# EasyEDA Pro project power_supply_14V.eprj

# Schematic Schematic1
Board Name: Board1; Create Date: 2025-10-17; Page Name: P1; Project Name: power_supply_14V; Schematic Name: Schematic1; Update Date: 2025-10-19; Company: 嘉立创EDA; Page Size: A4; Version: V1.0
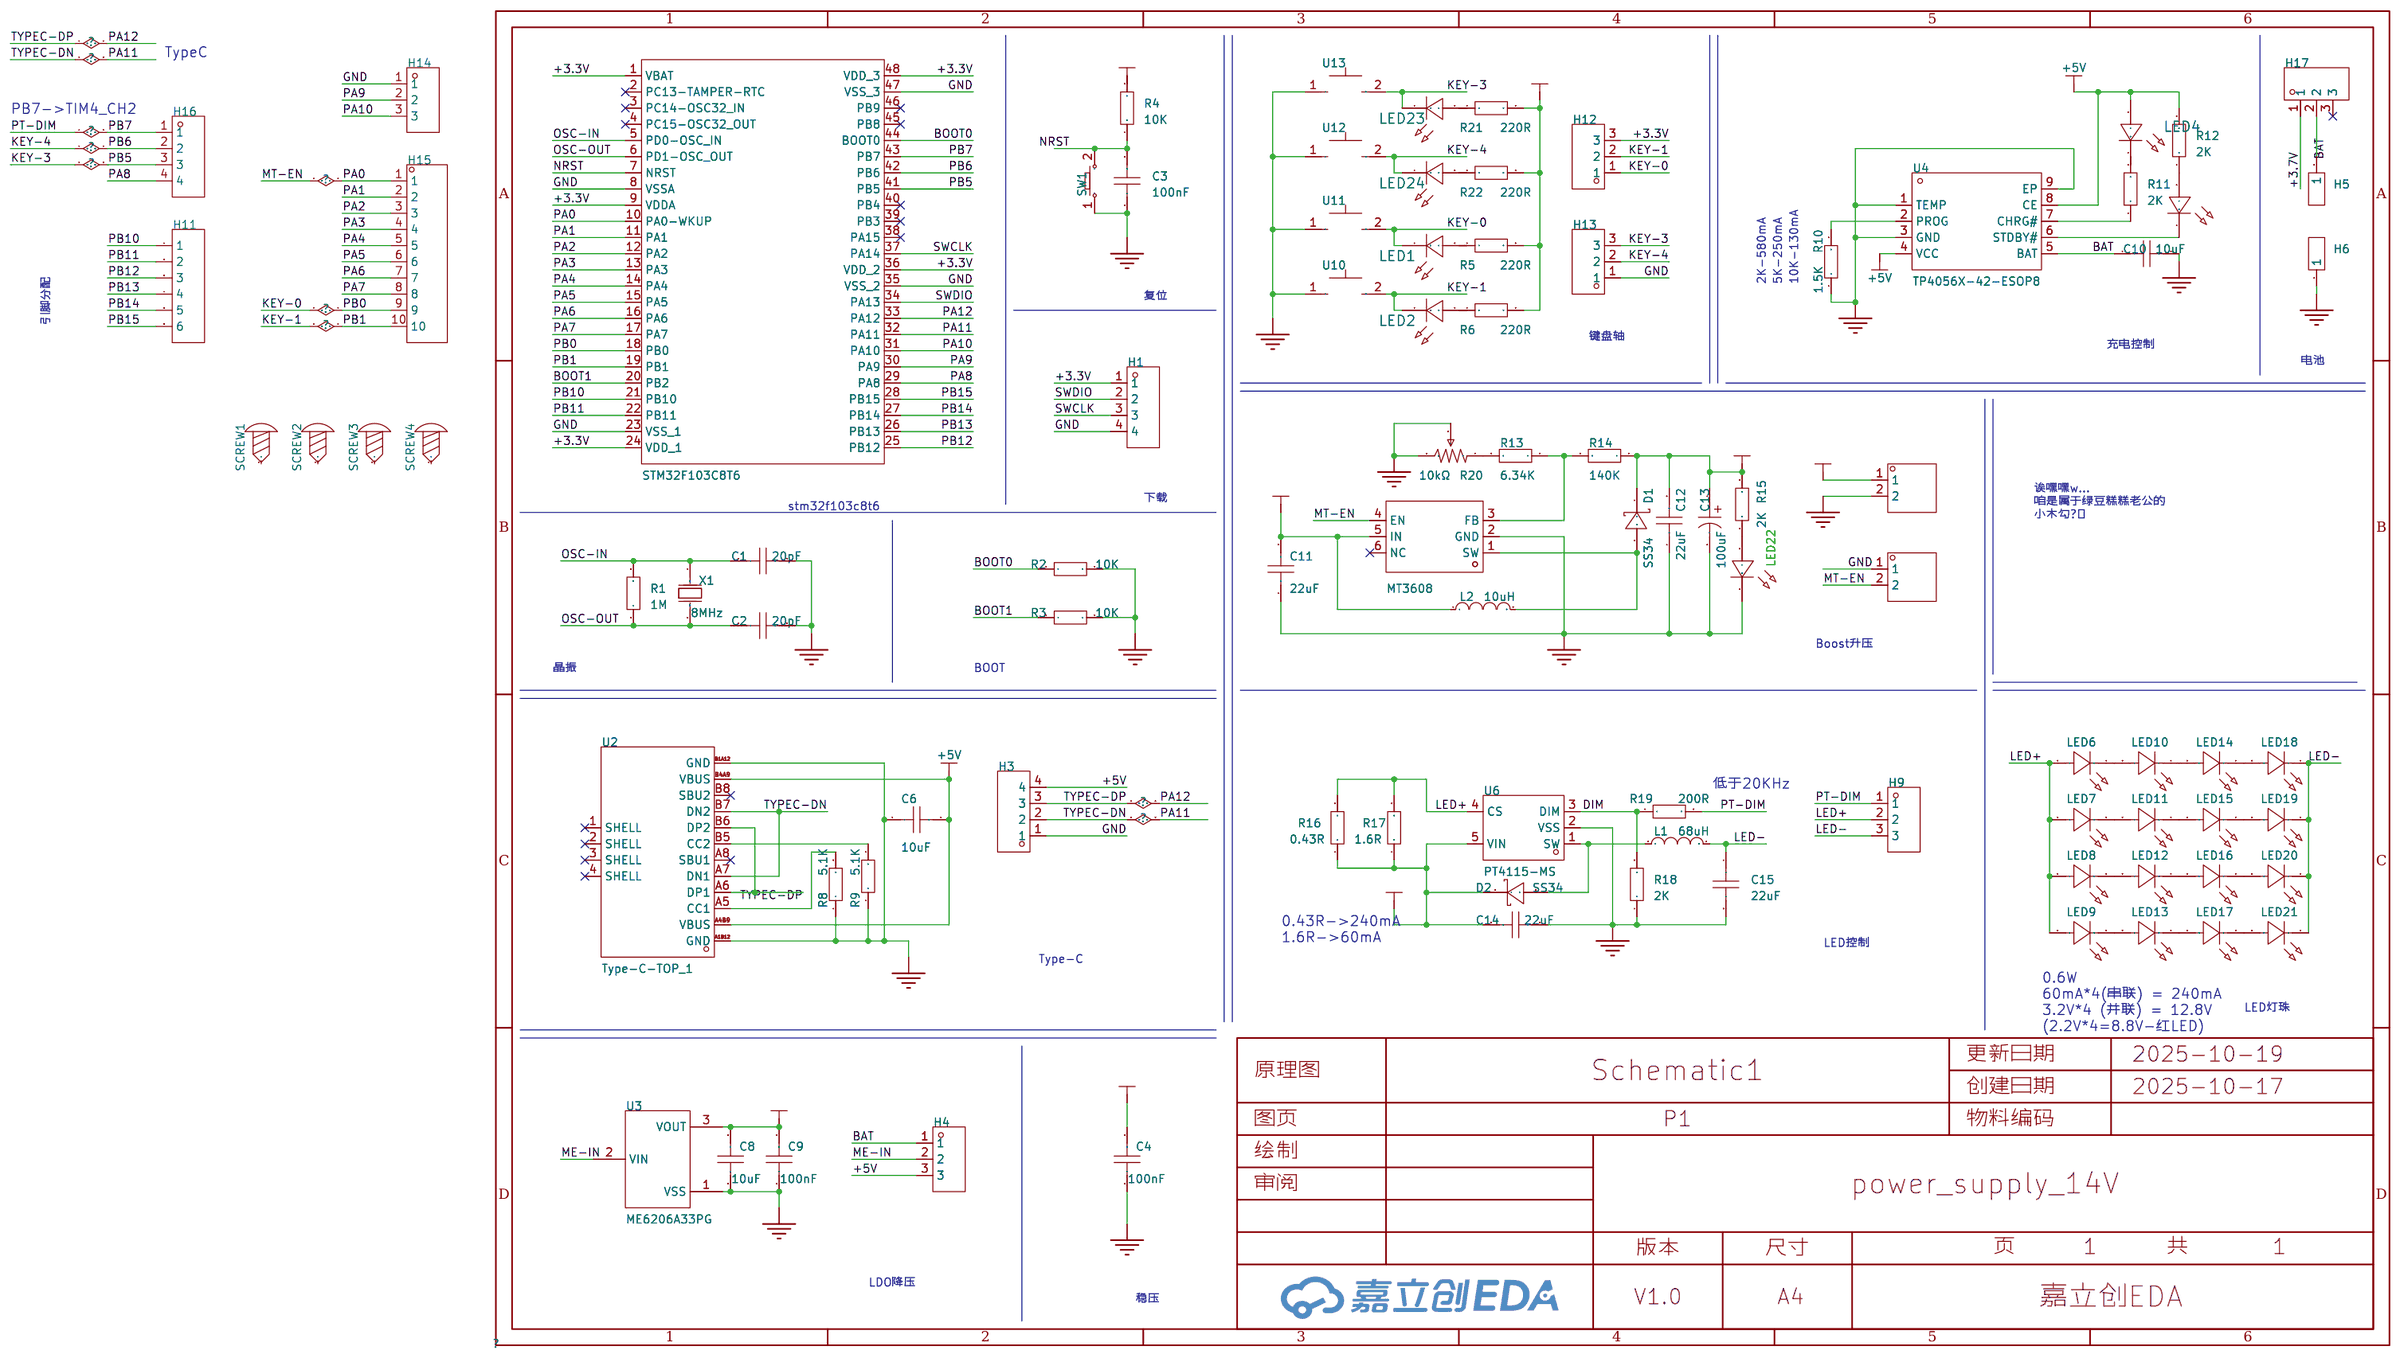
[diagram p0: schematic sheet]

## Parts
C1  20pF  [C0805]
C2  20pF  [C0805]
C3  100nF  [C0805]
C4  100nF  [C0805]
C6  10uF  [C0805]
C8  10uF  [C0805]
C9  100nF  [C0805]
C10  10uF  [C0805]
C11  22uF  [C0805]
C12  22uF  [C0805]
C13  100uF  [CAP-SMD_BD6.3-L6.6-W6.6-FD-1]
C14  22uF  [C0805]
C15  22uF  [C0805]
D1  SS34  [SMA_L4.3-W2.6-LS5.2-RD]
D2  SS34  [SMA_L4.3-W2.6-LS5.2-RD]
H1  -  [HDR-TH_4P-P2.54-V-M]
H3  -  [HDR-TH_4P-P2.54-V-M]
H4  -  [HDR-TH_3P-P2.54-V-M]
H5  -  [HDR-TH_1P-V-M_XKB_X4611WV-01I-C28D40]
H6  -  [HDR-TH_1P-V-M_XKB_X4611WV-01I-C28D40]
H7  -  [HDR-TH_2P-P2.54-V-M-1]
H8  -  [HDR-TH_2P-P2.54-V-M-1]
H9  -  [HDR-TH_3P-P2.54-V-M]
H11  -  [HDR-TH_6P-P2.54-V-M-1]
H12  -  [HDR-TH_3P-P2.54-V-M]
H13  -  [HDR-TH_3P-P2.54-V-M]
H14  -  [HDR-TH_3P-P2.54-V-M]
H15  -  [HDR-TH_10P-P2.54-V-M-1]
H16  -  [HDR-TH_4P-P2.54-V-F]
H17  -  [HDR-TH_3P-P2.54-V-M]
L1  68uH  [IND-SMD_L5.8-W5.2]
L2  10uH  [IND-SMD_L7.3-W6.6]
LED1  -  [LED_0805]
LED2  -  [LED_0805]
LED4  -  [LED_0805]
LED5  -  [LED_0805]
LED6  XL-2835UWC-02  [LED-SMD_L3.5-W2.8-RD_1.25T-2PWT]
LED7  XL-2835UWC-02  [LED-SMD_L3.5-W2.8-RD_1.25T-2PWT]
LED8  XL-2835UWC-02  [LED-SMD_L3.5-W2.8-RD_1.25T-2PWT]
LED9  XL-2835UWC-02  [LED-SMD_L3.5-W2.8-RD_1.25T-2PWT]
LED10  XL-2835UWC-02  [LED-SMD_L3.5-W2.8-RD_1.25T-2PWT]
LED11  XL-2835UWC-02  [LED-SMD_L3.5-W2.8-RD_1.25T-2PWT]
LED12  XL-2835UWC-02  [LED-SMD_L3.5-W2.8-RD_1.25T-2PWT]
LED13  XL-2835UWC-02  [LED-SMD_L3.5-W2.8-RD_1.25T-2PWT]
LED14  XL-2835UWC-02  [LED-SMD_L3.5-W2.8-RD_1.25T-2PWT]
LED15  XL-2835UWC-02  [LED-SMD_L3.5-W2.8-RD_1.25T-2PWT]
LED16  XL-2835UWC-02  [LED-SMD_L3.5-W2.8-RD_1.25T-2PWT]
LED17  XL-2835UWC-02  [LED-SMD_L3.5-W2.8-RD_1.25T-2PWT]
LED18  XL-2835UWC-02  [LED-SMD_L3.5-W2.8-RD_1.25T-2PWT]
LED19  XL-2835UWC-02  [LED-SMD_L3.5-W2.8-RD_1.25T-2PWT]
LED20  XL-2835UWC-02  [LED-SMD_L3.5-W2.8-RD_1.25T-2PWT]
LED21  XL-2835UWC-02  [LED-SMD_L3.5-W2.8-RD_1.25T-2PWT]
LED22  -  [LED_0805]
LED23  -  [LED_0805]
LED24  -  [LED_0805]
R1  1M  [R0805]
R2  10K  [R0805]
R3  10K  [R0805]
R4  10K  [R0805]
R5  220R  [R0805]
R6  220R  [R0805]
R8  5.1K  [R0805]
R9  5.1K  [R0805]
R10  1.5K  [R0805]
R11  2K  [R0805]
R12  2K  [R0805]
R13  6.34K  [R0805]
R14  140K  [R0805]
R15  2K  [R0805]
R16  0.43R  [R0805]
R17  1.6R  [R0805]
R18  2K  [R0805]
R19  200R  [R0805]
R20  10kΩ  [RES-ADJ-SMD_3P-L3.0-W3.8-P1.75-BR]
R21  220R  [R0805]
R22  220R  [R0805]
SCREW1  -  [M3螺丝]
SCREW2  -  [M3螺丝]
SCREW3  -  [M3螺丝]
SCREW4  -  [M3螺丝]
SW1  -  [Key_SMD_3x4x2]
U1  STM32F103C8T6  [LQFP-48_L7.0-W7.0-P0.50-LS9.0-BL]
U2  Type-C-TOP_1  [USB-C-SMD_TYPE-C16PIN]
U3  ME6206A33PG  [SOT-89-3_L4.5-W2.5-P1.50-LS4.2-BR]
U4  TP4056X-42-ESOP8  [SOP-8_L4.9-W3.9-P1.27-LS6.0-TL-EP]
U5  MT3608  [SOT-23-6_L2.9-W1.6-P0.95-LS2.8-BL]
U6  PT4115-MS  [SOT-89-5_L4.5-W2.5-P1.50-LS4.6-BL]
U10  -  [高特轴轴体]
U11  -  [高特轴轴体]
U12  CPG151101S11-16  [SMD_KEYBOARD-SW]
U13  CPG151101S11-16  [SMD_KEYBOARD-SW]
X1  8MHz  [CRYSTAL-SMD_L11.5-W4.8-LS12.7]

## Library data of the parts
C1-C4 C6 C8-C12 C14 C15 = CAP_0805: Supplier Footprint: 0805
C13 = JVJ25V100M6x5: LCSC Part Name: 100uF ±20% 25V; Supplier Part: C46550402; Manufacturer: JIERR(捷而瑞); Supplier Footprint: SMD,D6.3xL5.4mm; JLCPCB Part Class: 扩展库; Datasheet: https://item.szlcsc.com/datasheet/JVJ25V100M6x5/48680096.html; Supplier: LCSC; Tolerance: ±20%; Voltage Rating: 25V; Ripple Current: 72mA@120Hz; Diameter: 6.3mm; Height - Seated (Max): 5.4mm; Lifetime: 2000hrs@105℃; Operating Temperature: -55℃~+105℃
D1 D2 = SS34_C8678: LCSC Part Name: 电压:40V 电流:3A; Supplier Part: C8678; Manufacturer: MDD(辰达半导体); Supplier Footprint: SMA(DO-214AC); JLCPCB Part Class: 基础库; Datasheet: https://item.szlcsc.com/datasheet/SS34/9178.html; Supplier: LCSC; Diode Configuration: 独立式; Voltage - Forward(Vf@If): 550mV@3A; Voltage - DC Reverse(Vr): 40V; Current - Rectified: 3A; Reverse Leakage Current (Ir): 500uA@40V; Operating Junction Temperature Range: -55℃~+125℃
H1 H3 = HDR-M_2.54_1x4P: Supplier Part: C492403; Supplier Footprint: 插件
H4 H9 H12-H14 H17 = HDR-M_2.54_1x3P: Supplier Part: C2937625; Supplier Footprint: 插件
H5 H6 = HDR-M_2.54_1x1P: Supplier Part: C81276; Supplier Footprint: 插件; JLCPCB Part Class: Extended Part
H7 H8 = HDR-M_2.54_1x2P: Supplier Part: C124375; Supplier Footprint: 插件
H11 = HDR-M_2.54_1x6P: Supplier Part: C37208; Supplier Footprint: 插件
H15 = HDR-M_2.54_1x10P: Supplier Part: C57369; Supplier Footprint: 插件
H16 = HDR-F_2.54_1x4P: Supplier Part: C2718488; Supplier Footprint: 插件
L1 = MSCD54-680KT: LCSC Part Name: 68uH ±10%; Supplier Part: C915201; Manufacturer: MetalLions(美铼); Supplier Footprint: SMD,5.8x5.2mm; JLCPCB Part Class: 扩展库; Datasheet: https://atta.szlcsc.com/upload/public/pdf/source/20201106/C915140_34E6DDD06C756689AFD995263E08DECA.pdf; Supplier: LCSC; Tolerance: ±10%
L2 = SMMS0630-100M: LCSC Part Name: 10uH ±20% 5.5A; Supplier Part: C128692; Manufacturer: SXN(顺翔诺); Supplier Footprint: SMD,7.3x6.6mm; JLCPCB Part Class: 扩展库; Datasheet: https://item.szlcsc.com/datasheet/SMMS0630-100M/139977.html; Supplier: LCSC; Tolerance: ±20%; Current - Saturation(Isat): 5.5A; DC Resistance(DCR): 68mΩ
LED1 LED2 LED4 LED23 LED24 = LED_0805-R: Supplier Footprint: 0805
LED5 LED22 = LED_0805-G: Supplier Footprint: 0805
LED6-LED21 = XL-2835UWC-02: LCSC Part Name: 2835白0.2W贴片式发光二极管; Supplier Part: C2843876; Manufacturer: XINGLIGHT(成兴光); Supplier Footprint: SMD2835-2P; JLCPCB Part Class: 扩展库; Datasheet: https://item.szlcsc.com/datasheet/XL-2835UWC-02/3033177.html; Supplier: LCSC; Illumination Color: 白色; Voltage - Forward(Vf): 3.4V; Power(Watts): 200mW; Forward Current: 60mA; Lens Color: 黄色透镜; Color Temperature: 6000K~7500K; Viewing Angle: 120°; Mounting Style: 正贴; Operating Temperature: -20℃~+85℃
R1-R6 R8-R19 R21 R22 = Res_0805: Supplier Footprint: 0805
R20 = TC33X-2-103E: LCSC Part Name: 10kΩ ±25%; Supplier Part: C719176; Manufacturer: BOURNS; Supplier Footprint: SMD-3P,3.8x3.6mm; JLCPCB Part Class: 扩展库; Datasheet: https://item.szlcsc.com/datasheet/TC33X-2-103E/762158.html; Supplier: LCSC; Tolerance: ±25%; Power(Watts): 150mW; Temperature Coefficient: ±250ppm/℃; Number of Turns: 1
SCREW1-SCREW4 = M3螺丝: Supplier Footprint: 插件
SW1 = Key_SMD_3x4x2: Supplier Footprint: SMD
U1 = STM32F103C8T6_C9900100366: Supplier Part: C9900100366; Supplier Footprint: TH-6P; JLCPCB Part Class: 扩展库; Supplier: LCSC
U2 = Type-C-TOP_1: Supplier Part: C9900005857; Supplier Footprint: Type-C16P; JLCPCB Part Class: 扩展库; Supplier: LCSC
U3 = ME6206A33PG: 输出类型:固定;工作电压:6V;输出电压:3.3V;输出电流:300mA;电源纹波抑制比(PSRR):50dB@(1kHz);输出极性:正极;; LCSC Part Name: 输入6V 输出3.3V 300mA; Supplier Part: C79022; Manufacturer: MICRONE(南京微盟); Supplier Footprint: SOT-89-3; JLCPCB Part Class: 扩展库; Datasheet: https://item.szlcsc.com/datasheet/ME6206A33PG/80159.html; Supplier: LCSC; Output Type: 固定; Voltage - Supply: 6V; Output Voltage: 3.3V; Output Current: 300mA; Power Supply Rejection Ratio (PSRR): 50dB@(1kHz); Voltage Dropout: 180mV@(80mA)；380mV@(200mA); standby current: 9uA; Features: 过流保护; Operating Temperature: -25℃~+85℃; Output Configuration: 正极; Number of Outputs: 1
U4 = TP4056X-42-ESOP8: 工作电压:4V~8V;最大充电电流:1A;电池类型:锂离子/聚合物;电池节数:1;; Supplier Part: C2763448; Manufacturer: TOPPOWER(南京拓微); Supplier Footprint: SOP-8-EP; JLCPCB Part Class: 扩展库; Datasheet: https://item.szlcsc.com/datasheet/TP4056X-42-ESOP8/2893069.html; Supplier: LCSC; The Chip Type: 线性充电芯片; Voltage - Supply: 4V~8V; Charge Current - Max: 1A; Charging Saturation Voltage: 4.2V; Type of Battery: 锂离子/聚合物; Number of Cells: 1; Operating Temperature: -40℃~+85℃; Battery Temperature Detection: 支持; Supply Current (Iq): 70uA
U5 = MT3608: LCSC Part Name: 老版本 高效1.2MHz 2A升压转换器; Supplier Part: C84817; Manufacturer: 西安航天民芯; Supplier Footprint: SOT-23-6; JLCPCB Part Class: 扩展库; Datasheet: https://item.szlcsc.com/datasheet/MT3608/85988.html; Supplier: LCSC; Function: 升压型; Output Type: 可调; Voltage - Supply: 2V~24V; Output Current: 2A; Frequency - Switching: 1.2MHz; Operating Temperature: -40℃~+85℃; Synchronous Rectifier: 否; Number of Outputs: 1; Topology: 升压式; Quiescent Current: 100uA；1.6mA; Switch tube (built-in/external): 内置
U6 = PT4115-MS: LCSC Part Name: 降压型LED恒流驱动器; Supplier Part: C7473160; Manufacturer: MSKSEMI(美森科); Supplier Footprint: SOT89-5; JLCPCB Part Class: 扩展库; Datasheet: https://item.szlcsc.com/datasheet/PT4115-MS/8533534.html; Supplier: LCSC; Voltage - Input(DC): 5.5V~30V; Frequency - Switching: 1MHz; Number of Channels: 1; Output Current: 1A; Dimming: PWM；模拟; Topology: 降压; Operating temperature: -40℃~+150℃
U10 U11 = 高特轴-焊盘
U12 U13 = CPG151101S11-16_C41430893: LCSC Part Name: 热插拔底座连接器 键盘配件; Supplier Part: C41430893; Manufacturer: HanElectricity(瀚源); Supplier Footprint: SMD,14.5x5.9mm; JLCPCB Part Class: 扩展库; Datasheet: https://item.szlcsc.com/datasheet/CPG151101S11-16/43288200.html; Supplier: LCSC
X1 = X49SM8MSD2SC: 晶振类型:贴片晶振;频率:8MHz;常温频差:±20ppm;外接负载电容:20pF;频率稳定度(全温):±30ppm;; LCSC Part Name: 8MHz ±20ppm 20pF; Supplier Part: C12674; Manufacturer: YXC(扬兴晶振); Supplier Footprint: HC-49S-SMD; JLCPCB Part Class: 基础库; Datasheet: https://atta.szlcsc.com/upload/public/pdf/source/20240329/3EBF42EBCAB50CA65B6FA9D7CFA1955A.pdf; Supplier: LCSC; Crystal Type: 贴片晶振; Normal temperature Frequency Tolerance: ±20ppm; External load capacitor: 20pF; Frequency Stability(Full temperature range): ±30ppm; Operating Temperature: -20℃~+70℃; Check: true

## Nets
+3.3V: C4.2 C8.2 C9.2 H1.1 H12.3 R4.2 R5.2 R6.2 R21.2 R22.2 U1.1(VBAT) U1.9(VDDA) U1.24(VDD_1) U1.36(VDD_2) U1.48(VDD_3) U3.3(VOUT)
+3.7V: C11.2 H17.1 L2.1 U5.5(IN)
+5V: C6.2 H3.4 H4.3 LED4.2(A) R12.2 U2.A4B9(VBUS) U2.B4A9(VBUS) U4.4(VCC) U4.8(CE)
+14V: C12.2 C13.1 C14.2 D1.1(K) D2.1(K) H7.1 R14.1 R15.2 R16.1 R17.1 U6.5(VIN)
GND: C1.2 C2.2 C3.1 C4.1 C6.1 C8.1 C9.1 C10.2 C11.1 C12.1 C13.2 C14.1 C15.2 H1.4 H3.1 H6.1 H7.2 H8.1 H13.1 H14.1 LED22.1(C) R2.2 R3.2 R8.1 R9.1 R10.1 R18.1 R20.2 R20.3 SW1.1 U1.8(VSSA) U1.23(VSS_1) U1.35(VSS_2) U1.47(VSS_3) U2.A1B12(GND) U2.B1A12(GND) U3.1(VSS) U4.1(TEMP) U4.3(GND) U4.9(EP) U5.2(GND) U6.2(VSS) U10.1 U11.1 U12.1 U13.1
BAT: C10.1 H4.1 H5.1 H17.2 U4.5(BAT)
BOOT0: R2.1 U1.44(BOOT0)
BOOT1: R3.1 U1.20(PB2)
DIM: R18.2 R19.1 U6.3(DIM)
KEY-0: H12.1 H15.9 LED1.1(C) U1.18(PB0) U11.2
KEY-1: H12.2 H15.10 LED2.1(C) U1.19(PB1) U10.2
KEY-3: H13.3 H16.3 LED23.1(C) U1.41(PB5) U13.2
KEY-4: H13.2 H16.2 LED24.1(C) U1.42(PB6) U12.2
LED+: H9.2 LED6.2(A) LED7.2(A) LED8.2(A) LED9.2(A) R16.2 R17.2 U6.4(CS)
LED-: C15.1 H9.3 L1.2 LED18.1(K) LED19.1(K) LED20.1(K) LED21.1(K)
ME-IN: H4.2 U3.2(VIN)
MT-EN: H8.2 H15.1 U1.10(PA0-WKUP) U5.4(EN)
NRST: C3.2 R4.1 SW1.2 U1.7(NRST)
OSC-IN: C1.1 R1.2 U1.5(PD0-OSC_IN) X1.1(OSC1)
OSC-OUT: C2.1 R1.1 U1.6(PD1-OSC_OUT) X1.2(OSC2)
PA1: H15.2 U1.11(PA1)
PA2: H15.3 U1.12(PA2)
PA3: H15.4 U1.13(PA3)
PA4: H15.5 U1.14(PA4)
PA5: H15.6 U1.15(PA5)
PA6: H15.7 U1.16(PA6)
PA7: H15.8 U1.17(PA7)
PA8: H16.4 U1.29(PA8)
PA9: H14.2 U1.30(PA9)
PA10: H14.3 U1.31(PA10)
PA11: H3.2 U1.32(PA11) U2.A7(DN1) U2.B7(DN2)
PA12: H3.3 U1.33(PA12) U2.A6(DP1) U2.B6(DP2)
PB7: H9.1 H16.1 R19.2 U1.43(PB7)
PB10: H11.1 U1.21(PB10)
PB11: H11.2 U1.22(PB11)
PB12: H11.3 U1.25(PB12)
PB13: H11.4 U1.26(PB13)
PB14: H11.5 U1.27(PB14)
PB15: H11.6 U1.28(PB15)
SWCLK: H1.3 U1.37(PA14)
SWDIO: H1.2 U1.34(PA13)
$1N246: R13.1 R14.2 U5.3(FB)
$1N536: D1.2(A) L2.2 U5.1(SW)
$1N2412: D2.2(A) L1.1 U6.1(SW)
$1N3223: R11.1 U4.7(CHRG#)
$1N3224: LED5.1(C) U4.6(STDBY#)
$1N3229: R10.2 U4.2(PROG)
$1N3661: LED6.1(K) LED10.2(A)
$1N3707: LED10.1(K) LED14.2(A)
$1N3753: LED14.1(K) LED18.2(A)
$1N3931: LED7.1(K) LED11.2(A)
$1N3933: LED11.1(K) LED15.2(A)
$1N3935: LED15.1(K) LED19.2(A)
$1N4113: LED8.1(K) LED12.2(A)
$1N4115: LED12.1(K) LED16.2(A)
$1N4117: LED16.1(K) LED20.2(A)
$1N4295: LED9.1(K) LED13.2(A)
$1N4297: LED13.1(K) LED17.2(A)
$1N4299: LED17.1(K) LED21.2(A)
$1N4815: R8.2 U2.A5(CC1)
$1N4872: R9.2 U2.B5(CC2)
$1N5072: LED1.2(A) R5.1
$1N5233: LED2.2(A) R6.1
$1N7576: LED22.2(A) R15.1
$1N7618: R13.2 R20.1
$1N7867: LED23.2(A) R21.1
$1N7949: LED24.2(A) R22.1
$1N8425: LED5.2(A) R12.1
$1N10744: LED4.1(C) R11.2

Not connected (* = marked no-connect by the designer): H17 3*; SCREW1 1; SCREW2 1; SCREW3 1; SCREW4 1; U1 2(PC13-TAMPER-RTC)* 3(PC14-OSC32_IN)* 4(PC15-OSC32_OUT)* 38(PA15)* 39(PB3)* 40(PB4)* 45(PB8)* 46(PB9)*; U2 1(SHELL)* 2(SHELL)* 3(SHELL)* 4(SHELL)* A8(SBU1)* B8(SBU2)*; U5 6(NC)*

## Notes on the sheet
- TypeC
- PB7->TIM4_CH2
- 2K-580mA
- 5K-250mA
- 10K-130mA
- 复位
- 引脚分配
- 键盘轴
- 充电控制
- 电池
- stm32f103c8t6
- 下载
- 诶嘿嘿w...
  咱是属于绿豆糕糕老公的
  小木勾🥰❤️
- Boost升压
- 晶振
- BOOT
- 低于20KHz
- 0.43R->240mA
  1.6R->60mA
- LED控制
- Type-C
- 0.6W
  60mA*4(串联) = 240mA
  3.2V*4 (并联) = 12.8V
  (2.2V*4=8.8V-红LED)
- LED灯珠
- LDO降压
- 稳压

# Board PCB1
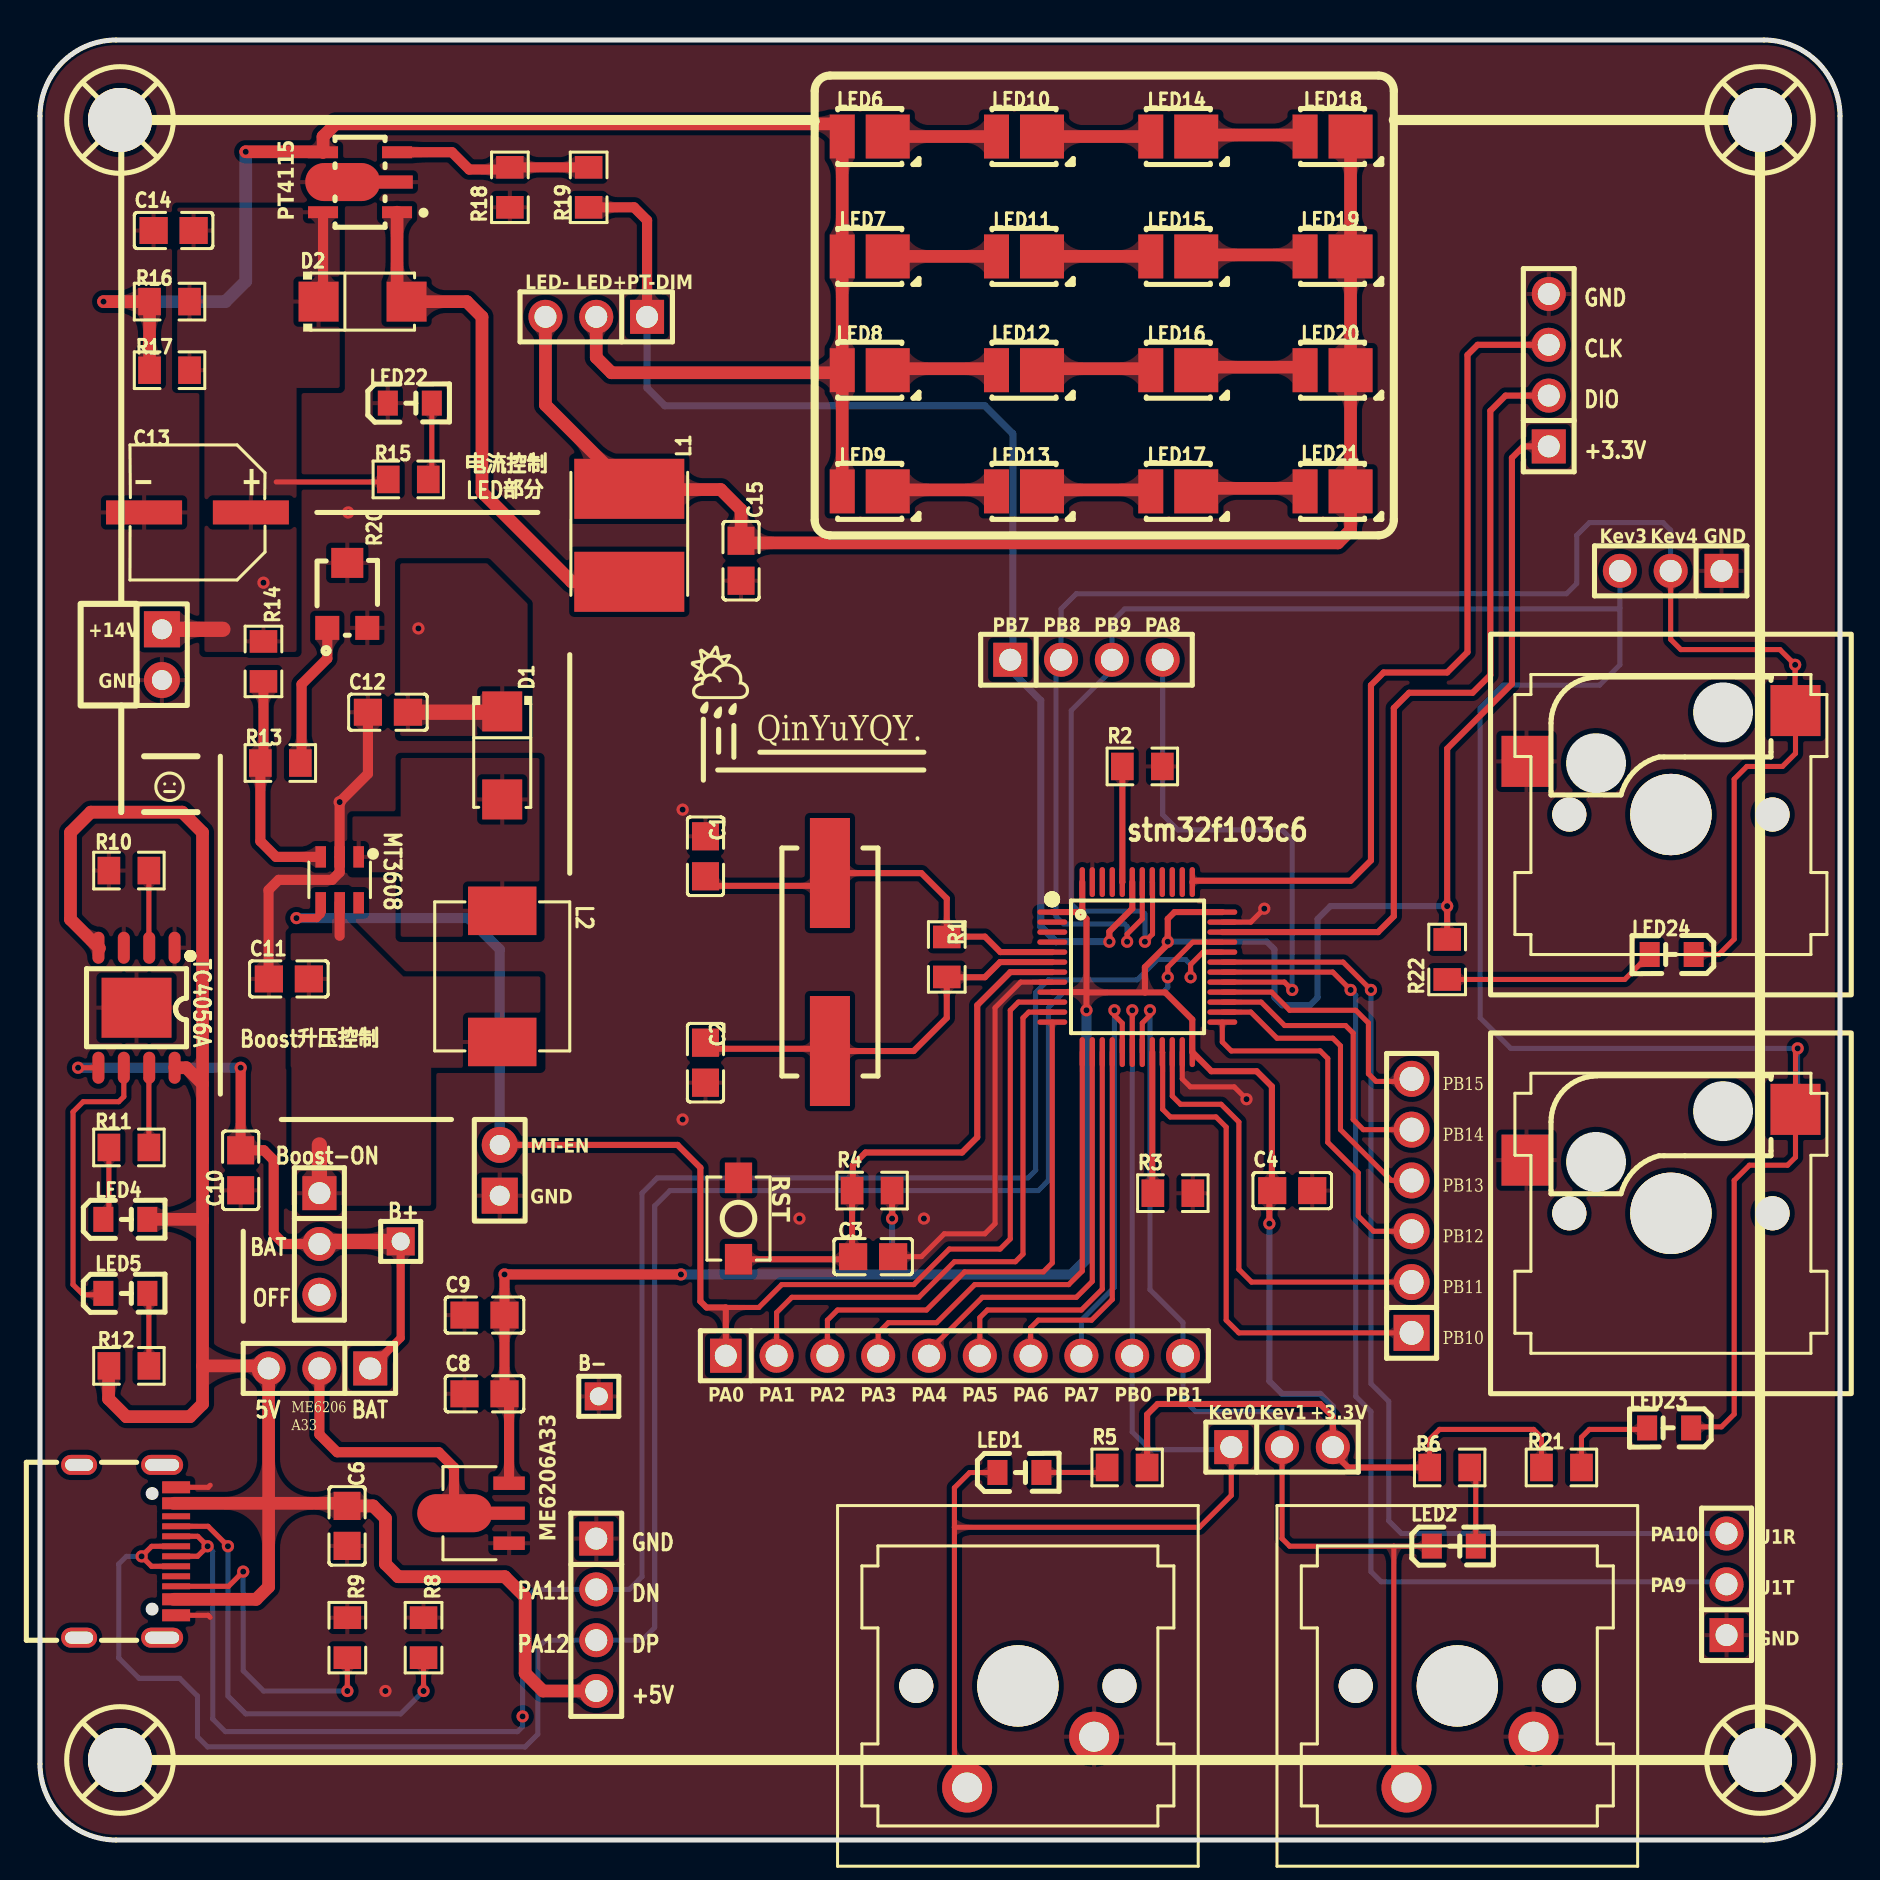
[diagram p1: board, top side]
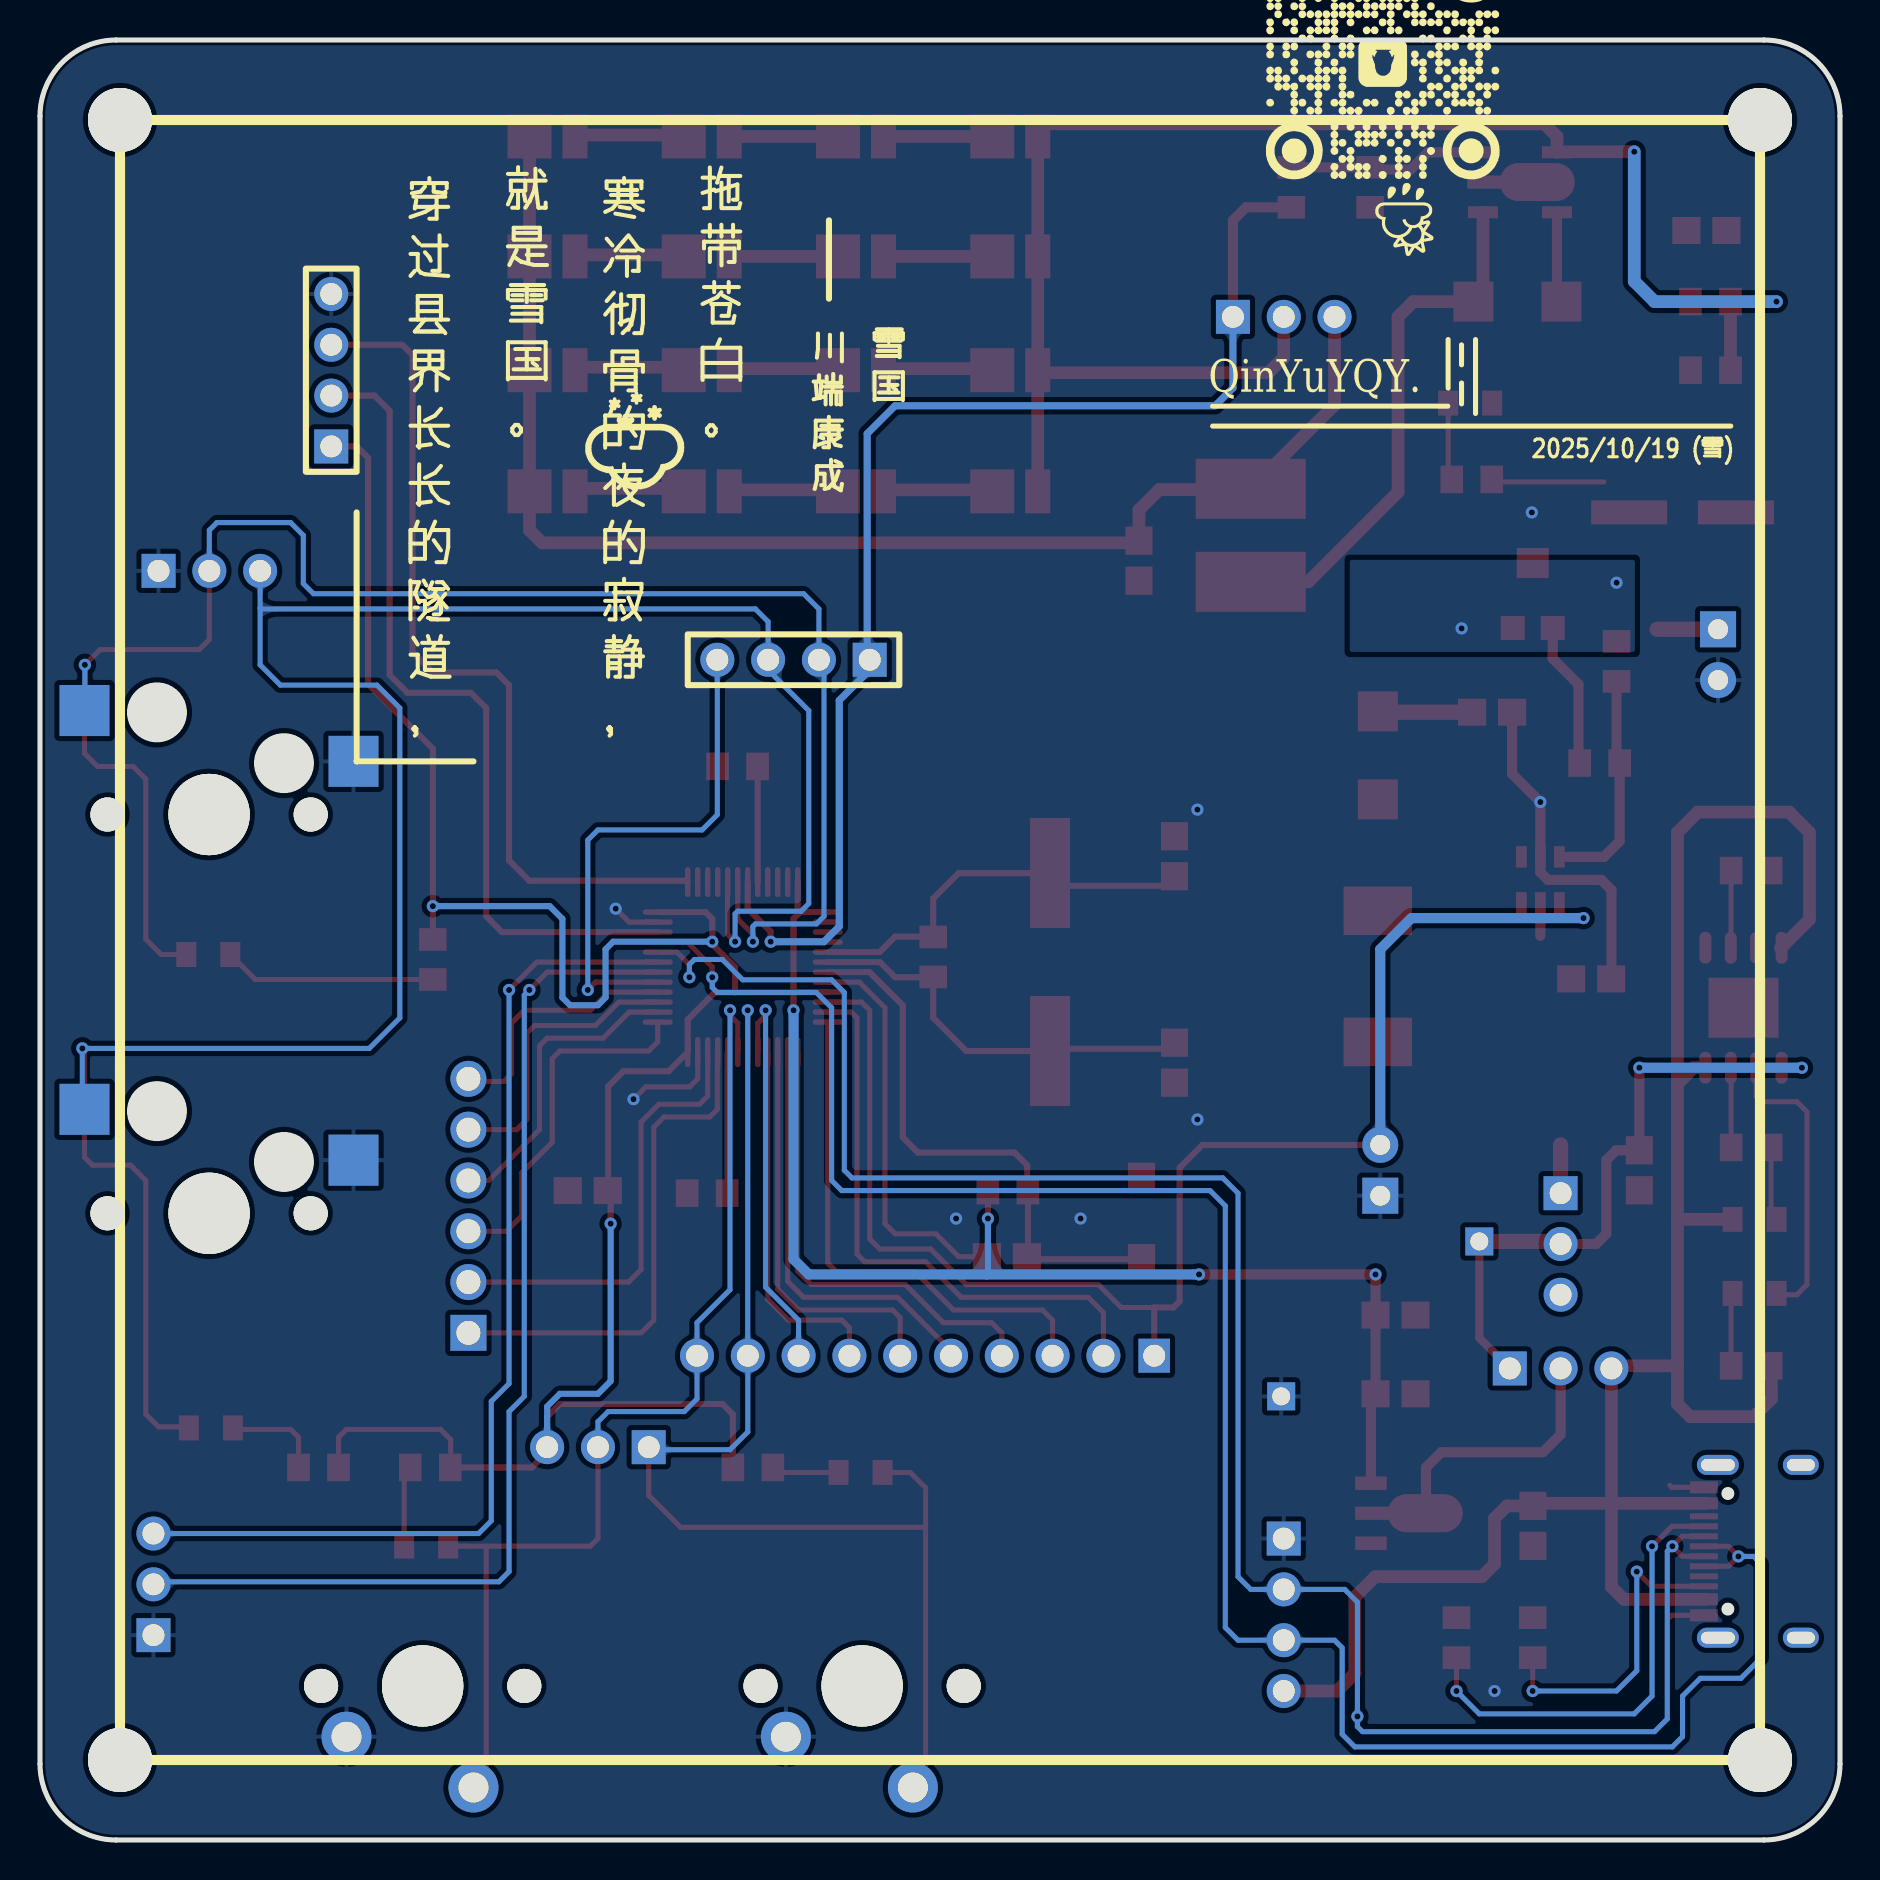
[diagram p2: board, bottom side, seen from below]

Outline 90 x 90 mm; copper layers: Top Layer, Bottom Layer. Coordinates in mm from the lower left corner of the outline.
Outline path: 0,86.19 0,3.81 arc(1.12,1.12) 3.81,0 86.19,0 arc(88.88,1.12) 90,3.81 90,86.19 arc(88.88,88.88) 86.19,90 3.81,90 arc(1.12,88.88) 0,86.19
Stack: Top Layer 0.035mm / Dielectric1 1.51mm FR4 er 4.5 / Bottom Layer 0.035mm

## Design rules (mm)
net OSC-IN: DP2
net OSC-OUT: DP2
template: 自定义配置
spacing copperThickness1oz (default): track to track 0.102, other pairs 0.152 to 0.3
spacing copperThickness2oz: track to track 0.203, other pairs 0.152 to 0.3
track width copperThickness1oz (default): min 0.127, default 0.254, max 2.54
track width copperThickness2oz: min 0.203, default 0.254, max 2.54
differential pair differentialPair (default): width min 0.127, default 0.254, max 2.54; gap min 0.152, default 0.152
via viaSize (default): diameter min 0.5, default 0.61, max 10; hole min 0.3, default 0.305, max 6.3

## Placement (name value [footprint] x y rotation side)
B-  -  [HDR-TH_1P-V-M_XKB_X4611WV-01I-C28D40]  27.94 22.18 0 top
C1  20pF  [C0805]  33.27 49.19 90 top
C2  20pF  [C0805]  33.27 38.87 270 top
C3  100nF  [C0805]  41.66 29.17 180 top
C4  100nF  [C0805]  62.61 32.47 180 top
C6  10uF  [C0805]  15.35 15.71 90 top
C8  10uF  [C0805]  22.22 22.31 0 top
C9  100nF  [C0805]  22.22 26.25 0 top
C10  10uF  [C0805]  10.03 33.48 270 top
C11  22uF  [C0805]  12.44 43.05 0 top
C12  22uF  [C0805]  17.4 56.39 0 top
C13  100uF  [CAP-SMD_BD6.3-L6.6-W6.6-FD-1]  7.87 66.38 180 top
C14  22uF  [C0805]  6.68 80.47 0 top
C15  22uF  [C0805]  35.05 63.97 270 top
D1  SS34  [SMA_L4.3-W2.6-LS5.2-RD]  23.11 54.23 270 top
D2  SS34  [SMA_L4.3-W2.6-LS5.2-RD]  16.13 76.92 0 top
H1  -  [HDR-TH_4P-P2.54-V-M]  75.44 73.49 90 top
H3  -  [HDR-TH_4P-P2.54-V-M]  27.81 11.26 270 top
H4  -  [HDR-TH_3P-P2.54-V-M]  13.97 23.58 180 top
H5  -  [HDR-TH_1P-V-M_XKB_X4611WV-01I-C28D40]  18.03 29.93 0 top
H7  -  [HDR-TH_2P-P2.54-V-M-1]  6.1 59.27 270 top
H8  -  [HDR-TH_2P-P2.54-V-M-1]  22.99 33.48 90 top
H9  -  [HDR-TH_3P-P2.54-V-M]  27.81 76.16 180 top
H11  -  [HDR-TH_6P-P2.54-V-M-1]  68.58 31.71 90 top
H12  -  [HDR-TH_3P-P2.54-V-M]  62.1 19.64 0 top
H13  -  [HDR-TH_3P-P2.54-V-M]  81.53 63.46 180 top
H14  -  [HDR-TH_3P-P2.54-V-M]  84.33 12.78 90 top
H15  -  [HDR-TH_10P-P2.54-V-M-1]  45.72 24.21 0 top
H16  -  [HDR-TH_4P-P2.54-V-F]  52.32 59.01 0 top
H17  -  [HDR-TH_3P-P2.54-V-M]  13.97 29.8 270 top
L1  68uH  [IND-SMD_L5.8-W5.2]  29.46 65.23 270 top
L2  10uH  [IND-SMD_L7.3-W6.6]  23.11 43.18 270 top
LED1  -  [LED_0805]  49.02 18.37 0 top
LED2  -  [LED_0805]  70.74 14.69 0 top
LED4  -  [LED_0805]  4.32 31.03 0 top
LED5  -  [LED_0805]  4.32 27.33 0 top
LED6  XL-2835UWC-02  [LED-SMD_L3.5-W2.8-RD_1.25T-2PWT]  41.25 85.17 180 top
LED7  XL-2835UWC-02  [LED-SMD_L3.5-W2.8-RD_1.25T-2PWT]  41.25 79.18 180 top
LED8  XL-2835UWC-02  [LED-SMD_L3.5-W2.8-RD_1.25T-2PWT]  41.25 73.49 180 top
LED9  XL-2835UWC-02  [LED-SMD_L3.5-W2.8-RD_1.25T-2PWT]  41.25 67.43 180 top
LED10  XL-2835UWC-02  [LED-SMD_L3.5-W2.8-RD_1.25T-2PWT]  48.96 85.17 180 top
LED11  XL-2835UWC-02  [LED-SMD_L3.5-W2.8-RD_1.25T-2PWT]  48.96 79.18 180 top
LED12  XL-2835UWC-02  [LED-SMD_L3.5-W2.8-RD_1.25T-2PWT]  48.96 73.49 180 top
LED13  XL-2835UWC-02  [LED-SMD_L3.5-W2.8-RD_1.25T-2PWT]  48.96 67.43 180 top
LED14  XL-2835UWC-02  [LED-SMD_L3.5-W2.8-RD_1.25T-2PWT]  56.68 85.17 180 top
LED15  XL-2835UWC-02  [LED-SMD_L3.5-W2.8-RD_1.25T-2PWT]  56.68 79.18 180 top
LED16  XL-2835UWC-02  [LED-SMD_L3.5-W2.8-RD_1.25T-2PWT]  56.68 73.49 180 top
LED17  XL-2835UWC-02  [LED-SMD_L3.5-W2.8-RD_1.25T-2PWT]  56.68 67.43 180 top
LED18  XL-2835UWC-02  [LED-SMD_L3.5-W2.8-RD_1.25T-2PWT]  64.39 85.17 180 top
LED19  XL-2835UWC-02  [LED-SMD_L3.5-W2.8-RD_1.25T-2PWT]  64.39 79.18 180 top
LED20  XL-2835UWC-02  [LED-SMD_L3.5-W2.8-RD_1.25T-2PWT]  64.39 73.49 180 top
LED21  XL-2835UWC-02  [LED-SMD_L3.5-W2.8-RD_1.25T-2PWT]  64.39 67.43 180 top
LED22  -  [LED_0805]  18.54 71.84 0 top
LED23  -  [LED_0805]  81.41 20.61 180 top
LED24  -  [LED_0805]  81.53 44.28 180 top
R1  1M  [R0805]  45.34 44.15 90 top
R2  10K  [R0805]  55.12 53.68 0 top
R3  10K  [R0805]  56.64 32.34 0 top
R4  10K  [R0805]  41.6 32.47 0 top
R5  220R  [R0805]  54.36 18.63 0 top
R6  220R  [R0805]  70.49 18.63 180 top
R8  5.1K  [R0805]  19.18 10.12 270 top
R9  5.1K  [R0805]  15.37 10.12 270 top
R10  1.5K  [R0805]  4.44 48.47 0 top
R11  2K  [R0805]  4.44 34.63 180 top
R12  2K  [R0805]  4.44 23.71 180 top
R13  6.34K  [R0805]  12.02 53.85 0 top
R14  140K  [R0805]  11.17 58.93 270 top
R15  2K  [R0805]  18.42 68.03 180 top
R16  0.43R  [R0805]  6.48 76.92 180 top
R17  1.6R  [R0805]  6.48 73.49 180 top
R18  2K  [R0805]  23.5 82.63 90 top
R19  200R  [R0805]  27.43 82.63 270 top
R20  10kΩ  [RES-ADJ-SMD_3P-L3.0-W3.8-P1.75-BR]  15.36 62.23 270 top
R21  220R  [R0805]  76.07 18.63 180 top
R22  220R  [R0805]  70.36 44.03 90 top
SCREW1  -  [M3螺丝]  4 4 0 top
SCREW2  -  [M3螺丝]  4 86 0 top
SCREW3  -  [M3螺丝]  86 86 0 top
SCREW4  -  [M3螺丝]  86 4 0 top
SW1  -  [Key_SMD_3x4x2]  34.93 31.07 270 top
U1  STM32F103C8T6  [LQFP-48_L7.0-W7.0-P0.50-LS9.0-BL]  54.86 43.64 270 top
U2  Type-C-TOP_1  [USB-C-SMD_TYPE-C16PIN]  4.32 14.44 270 top
U3  ME6206A33PG  [SOT-89-3_L4.5-W2.5-P1.50-LS4.2-BR]  22.1 16.34 0 top
U4  TP4056X-42-ESOP8  [SOP-8_L4.9-W3.9-P1.27-LS6.0-TL-EP]  4.83 41.61 270 top
U5  MT3608  [SOT-23-6_L2.9-W1.6-P0.95-LS2.8-BL]  14.98 48.01 180 top
U6  PT4115-MS  [SOT-89-5_L4.5-W2.5-P1.50-LS4.6-BL]  16 82.89 90 top
U10  -  [高特轴轴体]  70.87 5.16 0 top
U11  -  [高特轴轴体]  48.9 5.16 0 top
U12  CPG151101S11-16  [SMD_KEYBOARD-SW]  81.05 55.2 0 bottom
U13  CPG151101S11-16  [SMD_KEYBOARD-SW]  81.05 35.26 0 bottom
X1  8MHz  [CRYSTAL-SMD_L11.5-W4.8-LS12.7]  39.5 43.9 270 top

## Footprints (pads in the part's own frame, mm; a bottom-side part is the same pattern mirrored in y, then rotated)
C0805
  rect 1.41x1.35 smd: 1(-1,0) 2(1,0)
CAP-SMD_BD6.3-L6.6-W6.6-FD-1
  rect 3.8x1.2 smd: 1(-2.67,0) 2(2.67,0)
CRYSTAL-SMD_L11.5-W4.8-LS12.7
  rect 5.5x2 smd: 1(-4.45,0) 2(4.45,0)
HDR-TH_1P-V-M_XKB_X4611WV-01I-C28D40
  rect 1.4x1.4 hole 0.9: 1(0,0)
HDR-TH_2P-P2.54-V-M-1
  rect 1.8x1.8 hole 1: 1(-1.27,0)
  round 1.8 hole 1: 2(1.27,0)
HDR-TH_3P-P2.54-V-M
  rect 1.7x1.7 hole 1.1: 1(-2.54,0)
  round 1.7 hole 1.1: 2(0,0) 3(2.54,0)
HDR-TH_4P-P2.54-V-F
  rect 1.7x1.7 hole 1.1: 1(-3.81,0)
  round 1.7 hole 1.1: 2(-1.27,0) 3(1.27,0) 4(3.81,0)
HDR-TH_4P-P2.54-V-M
  rect 1.7x1.7 hole 1.1: 1(-3.81,0)
  round 1.7 hole 1.1: 2(-1.27,0) 3(1.27,0) 4(3.81,0)
HDR-TH_6P-P2.54-V-M-1
  rect 1.8x1.8 hole 1.2: 1(-6.35,0)
  round 1.8 hole 1.2: 2(-3.81,0) 3(-1.27,0) 4(1.27,0) 5(3.81,0) 6(6.35,0)
HDR-TH_10P-P2.54-V-M-1
  rect 1.575x1.7 hole 1.1: 1(-11.43,0)
  round 1.7 hole 1.1: 2(-8.89,0) 3(-6.35,0) 4(-3.81,0) 5(-1.27,0) 6(1.27,0) 7(3.81,0) 8(6.35,0) 9(8.89,0) 10(11.43,0)
IND-SMD_L5.8-W5.2
  rect 3x5.5 smd: 1(2.325,0) 2(-2.325,0)
IND-SMD_L7.3-W6.6
  rect 2.424x3.42 smd: 1(3.278,0) 2(-3.278,0)
Key_SMD_3x4x2
  rect 1.53x1.36 smd: 1(-2.035,0) 2(2.035,0)
LED-SMD_L3.5-W2.8-RD_1.25T-2PWT
  rect 2.2x2.2 smd: 1(-1.137,0)
  rect 1.25x2.2 smd: 2(1.137,0)
LED_0805
  rect 1x1.25 smd: 1(-1.15,0.005) 2(1.05,0.005)
LQFP-48_L7.0-W7.0-P0.50-LS9.0-BL
  oval 0.27x1.5 smd: 1(-2.75,-4.25) 2(-2.25,-4.25) 3(-1.75,-4.25) 4(-1.25,-4.25) 5(-0.75,-4.25) 6(-0.25,-4.25) 7(0.25,-4.25) 8(0.75,-4.25) 9(1.25,-4.25) 10(1.75,-4.25) 11(2.25,-4.25) 12(2.75,-4.25) 25(2.75,4.25) 26(2.25,4.25) 27(1.75,4.25) 28(1.25,4.25) 29(0.75,4.25) 30(0.25,4.25) 31(-0.25,4.25) 32(-0.75,4.25) 33(-1.25,4.25) 34(-1.75,4.25) 35(-2.25,4.25) 36(-2.75,4.25)
  oval 1.5x0.27 smd: 13(4.25,-2.75) 14(4.25,-2.25) 15(4.25,-1.75) 16(4.25,-1.25) 17(4.25,-0.75) 18(4.25,-0.25) 19(4.25,0.25) 20(4.25,0.75) 21(4.25,1.25) 22(4.25,1.75) 23(4.25,2.25) 24(4.25,2.75) 37(-4.25,2.75) 38(-4.25,2.25) 39(-4.25,1.75) 40(-4.25,1.25) 41(-4.25,0.75) 42(-4.25,0.25) 43(-4.25,-0.25) 44(-4.25,-0.75) 45(-4.25,-1.25) 46(-4.25,-1.75) 47(-4.25,-2.25) 48(-4.25,-2.75)
M3螺丝
  round 3.2 hole 3.2: 1(0,0)
R0805
  rect 1.133x1.377 smd: 1(-1,0) 2(1,0)
RES-ADJ-SMD_3P-L3.0-W3.8-P1.75-BR
  rect 1.2x1.2 smd: 1(1.625,-1) 3(1.625,1)
  rect 1.5x1.6 smd: 2(-1.625,0)
SMA_L4.3-W2.6-LS5.2-RD
  rect 2x2 smd: 1(-2.2,0) 2(2.2,0)
SMD_KEYBOARD-SW
  round 1.702 hole 1.707x1.702: (-4.584,3.928) (5.576,3.928)
  round 4.064 hole 4.069x4.064: (0.496,3.928)
  rect 2.5x2.55 smd far side: 1(-6.725,1.27) 2(6.725,-1.27)
  rect 2.5x2.55 smd: 1(-6.725,1.27) 2(6.725,-1.27)
SOP-8_L4.9-W3.9-P1.27-LS6.0-TL-EP
  oval 1.6x0.6 smd: 1(-3,1.905) 2(-3,0.635) 3(-3,-0.635) 4(-3,-1.905) 5(3,-1.905) 6(3,-0.635) 7(3,0.635) 8(3,1.905)
  rect 3x3.5 smd: 9(0,0)
SOT-23-6_L2.9-W1.6-P0.95-LS2.8-BL
  rect 0.532x1.072 smd: 1(-0.95,-1.149) 2(0,-1.149) 3(0.95,-1.149) 4(0.95,1.149) 5(0,1.149) 6(-0.95,1.149)
SOT-89-3_L4.5-W2.5-P1.50-LS4.2-BR
  rect 1.575x0.672 smd: 1(1.356,-1.5) 3(1.356,1.5)
  custom 5.377x1.9 smd: 2(-1.356,0)
SOT-89-5_L4.5-W2.5-P1.50-LS4.6-BL
  rect 0.6x1.5 smd: 1(-1.5,-1.85) 3(1.5,-1.85) 4(1.5,1.85) 5(-1.5,1.85)
  custom 1.901x5.377 smd: 2(0.009,0.863)
USB-C-SMD_TYPE-C16PIN
  oval 1x2.1 hole 0.6x1.7: 1(-4.32,1.788) 2(4.32,1.788)
  oval 1x1.8 hole 0.6x1.4: 3(-4.32,-2.362) 4(4.32,-2.362)
  rect 0.6x1.4 smd: A1B12(-3.2,2.487) A4B9(-2.4,2.487) B1A12(3.2,2.487) B4A9(2.4,2.487)
  rect 0.3x1.4 smd: A5(-1.25,2.487) A6(-0.25,2.487) A7(0.25,2.487) A8(1.25,2.487) B5(1.75,2.487) B6(0.75,2.487) B7(-0.75,2.487) B8(-1.75,2.487)
高特轴轴体
  round 1.702 hole 1.707x1.702: (-5.08,2.54) (5.08,2.54)
  round 4.064 hole 4.069x4.064: (0,2.54)
  round 2.5 hole 1.5: 1(3.81,0) 2(-2.54,-2.54)

## Nets
As in the schematic, except:
GND: B-.1 C1.2 C2.2 C3.1 C4.1 C6.1 C8.1 C9.1 C10.2 C11.1 C12.1 C13.2 C14.1 C15.2 H1.4 H3.1 H7.2 H8.1 H13.1 H14.1 LED22.1 R2.2 R3.2 R8.1 R9.1 R10.1 R18.1 R20.2 R20.3 SW1.1 U1.8 U1.23 U1.35 U1.47 U2.A1B12 U2.B1A12 U3.1 U4.1 U4.3 U4.9 U5.2 U6.2 U10.1 U11.1 U12.1 U13.1

Pads without a net: H17 3; SCREW1 1; SCREW2 1; SCREW3 1; SCREW4 1; U1 2 3 4 38 39 40 45 46; U2 1 2 3 4 A8 B8; U5 6

## Via types
v1: diameter 0.61, hole 0.305, Top Layer to Bottom Layer, 43 vias

## Routing (per net, layer and track width the routed paths; a pad name or vN(x,y) marks a point on that pad's centre or on a via; arc(x,y) is an arc through that point)
+3.3V: length 182.8
  Top Layer w0.254: R6.2 69.47,18.64 69.47,20.02 69.98,20.53 74.68,20.53 75.07,20.13 R21.2
  Top Layer w0.305: 51.99,46.39 52.32,46.06 52.32,42.38 ; 51.99,46.39 U1.1 ; 51.99,46.39 52.11,46.52 U1.48 ; v1(61.47,30.82) 61.47,32.33 C4.2 61.59,32.48 61.59,37.68 60.83,38.44 58.57,38.44 U1.24 57.61,41.02 56.26,42.38 55.25,42.38 ; H1.1 74.17,69.68 73.6,69.11 73.6,57.81 70.36,54.57 v1(70.36,46.69) R22.2 ; R4.2 v1(42.6,31.07) ; U1.36 56.72,46.39 56.39,46.06 56.39,44.79 55.25,43.64 55.25,42.38 ; 52.32,42.38 52.31,42.39 U1.9 ; 52.32,42.38 v1(52.32,41.49) ; 52.32,42.38 55.25,42.38 ; R6.2 65.41,18.63 64.64,19.39 H12.3 64.64,21.17 64.01,21.8 55.88,21.8 55.36,21.28 R5.2
  Top Layer w0.508: v1(32.05,28.28) v1(23.22,28.28) C9.2 C8.2 23.45,22.08 U3.3
  Bottom Layer w0.305: H12.3 64.64,21.67 64.01,22.31 62.1,22.31 61.47,22.94 v1(61.47,30.82) ; 42.66,28.28 42.6,28.33 v1(42.6,31.07) ; v1(70.36,46.69) 64.52,46.69 63.88,46.06 63.88,42.12 63.5,41.74 62.1,41.74 61.72,42.12 61.72,44.53 61.34,44.92 v1(56.39,44.92)
  Bottom Layer w0.508: v1(52.32,41.49) 52.32,29.04 51.56,28.28 v1(32.05,28.28)
+3.7V: length 4.1
  Top Layer w0.508: 14.98,46.86 14.98,45.21
  Top Layer w0.762: H17.1 13.97,34.75
+5V: length 101.8
  Top Layer w0.635: 11.43,16.91 11.35,16.84 6.68,16.84 ; 11.43,16.91 11.43,16.84 ; 11.43,16.91 H4.3 11.3,23.71 8.13,23.71 ; 8.13,30.98 8.13,23.71 ; 8.13,30.98 8.13,37.8 ; 8.13,30.98 8.08,31.03 LED4.2 ; 8.13,23.71 8.13,21.8 7.49,21.17 4.32,21.17 3.43,22.06 3.43,23.69 R12.2 ; 11.43,16.84 15.22,16.84 C6.2 16.65,16.71 17.27,16.09 17.27,13.8 17.91,13.16 23.24,13.16 24.26,12.15 24.26,8.34 25.15,7.45 H3.4 ; 11.43,16.84 11.43,12.66 10.81,12.03 6.68,12.03 ; 8.13,37.8 7.32,38.61 U4.8 ; 8.13,37.8 8.13,50.38 7.11,51.39 2.54,51.39 1.52,50.38 1.52,46.03 2.96,44.59 2.96,44.57
+14V: length 18.4
  Top Layer w0.254: R15.2 17.29,67.9 11.81,67.9
  Top Layer w0.508: D2.1 14.15,77.14 U6.5
  Top Layer w0.762: C12.2 23.07,56.39 23.11,56.43 ; 5.72,60.54 9.14,60.54
  vias: v1(11.17,62.87) v1(18.92,60.58)
GND: length 47.8
  Top Layer w0.254: v1(60.32,37.04) 59.71,37.66 57.51,37.66 57.11,38.06 U1.23 ; 8.51,11.13 8.41,11.24 U2.B1A12 ; v1(61.21,46.57) 60.54,45.89 U1.35 ; U2.A1B12 8.41,17.63 8.51,17.74 ; C3.1 44.07,29.17 45.21,30.31 47.24,30.31 47.75,30.82 47.75,41.61 49.03,42.89 U1.8
  Top Layer w0.508: C11.1 11.43,43.07 11.43,47.5 11.94,48.01 14.6,48.01 14.98,48.39 U5.2 v1(14.98,51.9) 16.4,53.31 C12.1
  vias: v1(15.41,66.38) v1(17.27,7.45) v1(32.13,51.52) v1(32.13,36.03) v1(37.97,31.07) v1(44.2,31.07)
BAT: length 32.4
  Top Layer w0.254: U4.5 v1(1.91,38.61)
  Top Layer w0.406: H5.1 18.03,25.1 H4.1
  Top Layer w0.508: H17.2 12.19,29.8 11.68,30.31 11.68,33.99 11.19,34.48 C10.1 v1(10.03,38.61)
  Top Layer w0.762: H5.1 14.1,29.93 H17.2
  Bottom Layer w0.508: v1(1.91,38.61) v1(10.03,38.61)
BOOT0: length 5.8
  Top Layer w0.305: R2.1 54.12,47.9 U1.44
BOOT1: length 7.1
  Top Layer w0.305: R3.1 55.61,32.37 U1.20
DIM: length 10
  Top Layer w0.508: U6.3 20.6,84.39 21.46,83.52 23.38,83.52 R18.2 R19.1
KEY-0: length 63.2
  Top Layer w0.254: U1.18 v1(54.61,41.49) ; 45.72,15.64 45.72,3.26 U11.2 ; 45.72,15.64 57.97,15.64 59.56,17.23 H12.1 ; 45.72,15.64 45.72,17.61 46.48,18.37 47.87,18.37 LED1.1
  Bottom Layer w0.254: H12.1 59.44,19.51 55.5,19.51 54.61,20.4 H15.9 54.61,24.22 v1(54.61,41.49)
KEY-1: length 53.6
  Top Layer w0.254: v1(55.5,41.49) 55.5,41.23 55.11,40.85 U1.19 ; LED2.1 68.71,14.69 68.71,14.69 67.69,14.69 ; 67.69,14.69 62.48,14.69 62.1,15.07 H12.2 ; 67.69,14.69 67.69,3.26 U10.2
  Bottom Layer w0.254: H12.2 62.1,20.91 61.59,21.42 57.78,21.42 57.15,22.06 H15.10 57.15,25.86 55.5,27.52 v1(55.5,41.49)
KEY-3: length 119.9
  Top Layer w0.254: U1.41 55.63,47.88 55.63,45.3 v1(55.25,44.92) ; v1(87.88,39.58) 87.78,39.47 U13.2 87.78,34.14 87.38,33.74 85.47,33.74 84.71,32.98 84.71,21.29 84.07,20.66 82.61,20.66 82.56,20.6
  Bottom Layer w0.254: 78.99,61.59 78.99,58.76 77.98,57.74 73.15,57.74 72.01,56.6 72.01,41.11 73.53,39.58 v1(87.88,39.58) 87.88,36.64 U13.2 ; 78.99,61.59 78.96,61.55 54.23,61.55 53.59,60.92 H16.3 53.59,58.5 51.56,56.47 51.56,46.82 51.94,46.44 55.12,46.44 55.25,46.31 v1(55.25,44.92) ; 78.99,61.59 H13.3
KEY-4: length 90.2
  Top Layer w0.254: U1.42 55.11,46.05 54.36,45.3 v1(54.36,44.92) ; 87.78,56.26 87.78,54.33 87.12,53.68 85.34,53.68 84.71,53.04 84.71,45.04 83.94,44.28 LED24.1 ; 87.78,56.26 87.76,56.28 v1(87.76,58.76) 87,59.52 82.04,59.52 81.53,60.03 H13.2 ; 87.78,56.26 U12.2
  Bottom Layer w0.254: v1(54.36,44.92) 54.36,45.68 54.23,45.8 51.18,45.8 50.8,46.19 50.8,58.76 H16.2 51.05,61.55 51.82,62.31 76.33,62.31 76.84,62.82 76.84,65.23 77.47,65.87 81.15,65.87 81.53,65.49 H13.2 ; U12.2 87.76,56.49 v1(87.76,58.76)
LED+: length 83.6
  Top Layer w0.635: v1(3.17,76.92) R16.2 R17.2 ; LED8.2 LED7.2 LED6.2 40.11,85.7 40,85.81 14.79,85.81 14.15,85.17 U6.4 14.13,84.41 v1(10.29,84.41) ; LED8.2 LED9.2 ; LED8.2 39.98,73.36 28.57,73.36 27.81,74.12 H9.2
  Bottom Layer w0.635: v1(3.17,76.92) 9.27,76.92 10.29,77.94 v1(10.29,84.41)
LED-: length 68.4
  Top Layer w0.635: H9.3 25.27,71.75 L1.2 29.5,67.52 34.04,67.52 35.05,66.5 C15.1 35.16,64.86 64.89,64.86 65.53,65.49 LED21.1 LED20.1 LED19.1 LED18.1
ME-IN: length 13
  Top Layer w0.508: U3.2 20.7,16.38 20.7,18.63 19.94,19.39 14.86,19.39 13.97,20.28 H4.2
MT-EN: length 72.8
  Top Layer w0.254: U1.10 48.92,41.89 48.51,41.49 48.51,30.06 48.01,29.55 45.47,29.55 43.69,27.77 37.08,27.77 35.94,26.63 34.29,26.63
  Top Layer w0.305: H8.2 31.88,34.75 33.02,33.61 33.02,26.93 33.32,26.63 34.29,26.63 H15.1
  Top Layer w0.406: v1(12.82,46.09) 13.83,46.09 14.03,46.29 14.03,46.86
  Bottom Layer w0.508: v1(12.82,46.09) 21.43,46.09 22.99,44.53 H8.2
NRST: length 28.7
  Top Layer w0.305: SW1.2 40.42,29.04 40.6,29.22 ; 40.6,29.22 40.6,32.22 40.64,32.25 40.64,33.74 41.28,34.37 46.1,34.37 46.86,35.14 46.86,41.74 48.52,43.39 U1.7 ; 40.6,29.22 40.6,28.71 40.66,28.66
OSC-IN: length 20.6
  Top Layer w0.305: U1.5 48.02,44.39 47.24,45.17 45.35,45.17 R1.2 45.34,47.07 44.07,48.34 39.5,48.34 X1.1 38.86,47.71 33.75,47.71 C1.1
OSC-OUT: length 20.6
  Top Layer w0.305: C2.1 33.58,39.56 39.38,39.56 X1.2 43.68,39.45 45.34,41.11 R1.1 45.35,43.14 47.24,43.14 48,43.89 U1.6
PA1: length 29.1
  Top Layer w0.254: H15.2 36.83,26.37 37.59,27.14 43.94,27.14 45.72,28.91 48.77,28.91 49.15,29.29 49.15,41.11 49.44,41.39 U1.11
PA2: length 26.2
  Top Layer w0.254: U1.12 50.61,28.85 50.16,28.41 46.23,28.41 44.32,26.5 39.88,26.5 39.37,25.99 H15.3
PA3: length 23.6
  Top Layer w0.254: H15.4 41.91,25.36 42.42,25.86 44.83,25.86 46.74,27.77 51.44,27.77 52.11,28.45 U1.13
PA4: length 21.3
  Top Layer w0.254: U1.14 52.61,27.93 51.82,27.14 47.12,27.14 44.45,24.47 H15.5
PA5: length 20.5
  Top Layer w0.254: H15.6 46.99,26.12 47.37,26.5 52.07,26.5 53.11,27.54 U1.15
PA6: length 18.4
  Top Layer w0.254: H15.7 49.53,25.61 49.91,25.99 52.58,25.99 53.61,27.03 U1.16
PA7: length 20.2
  Top Layer w0.254: U1.17 54.11,40.84 53.72,41.23 v1(53.72,41.49)
  Bottom Layer w0.254: v1(53.72,41.49) 53.72,27.64 52.07,25.99 H15.8
PA8: length 25.7
  Top Layer w0.254: U1.29 62.22,42.89 v1(62.61,42.5)
  Bottom Layer w0.254: 56.26,58.76 56.13,58.63 56.13,51.27 56.9,50.5 62.1,50.5 62.61,50 v1(62.61,42.5)
PA9: length 54.3
  Top Layer w0.254: v1(65.53,42.5) 64.64,43.39 U1.30
  Bottom Layer w0.254: H14.2 84.2,12.91 67.06,12.91 66.55,13.42 66.55,21.42 65.79,22.18 65.79,42.25 v1(65.53,42.5)
PA10: length 52.1
  Top Layer w0.254: U1.31 65.16,43.89 v1(66.55,42.5)
  Bottom Layer w0.254: H14.3 68.07,15.32 67.44,15.96 67.44,21.93 66.55,22.82 v1(66.55,42.5)
PA11: length 101
  Top Layer w0.254: v1(57.53,43.14) 57.53,43.77 58.15,44.39 U1.32 ; 6.68,14.19 7.88,14.19 v1(8.38,14.69) 7.89,15.19 6.68,15.19
  Bottom Layer w0.254: v1(8.38,14.69) 8.64,14.44 8.64,6.05 9.27,5.42 23.88,5.42 24.13,5.67 v1(24.13,6.18) 24.13,11.9 24.77,12.53 H3.2 29.46,12.53 30.1,13.16 30.1,32.34 30.86,33.1 49.4,33.1 49.78,33.48 49.78,42.38 50.42,43.01 54.86,43.01 55.88,44.03 57.28,44.03 57.53,43.77 v1(57.53,43.14)
PA12: length 105
  Top Layer w0.254: v1(56.39,43.14) 56.39,43.64 57.64,44.89 U1.33 ; 6.68,14.69 5.58,14.69 v1(5.08,14.18) 5.58,13.69 6.68,13.69
  Bottom Layer w0.254: v1(5.08,14.18) 4.32,14.18 3.94,13.8 3.94,9.1 4.95,8.09 6.98,8.09 7.87,7.2 7.87,5.16 8.38,4.66 24.26,4.66 24.89,5.29 24.89,9.61 25.27,9.99 H3.3 30.1,9.99 30.73,10.62 30.73,31.71 31.5,32.47 49.91,32.47 50.42,32.98 50.42,41.61 51.18,42.38 56.13,42.38 56.39,42.63 v1(56.39,43.14)
PB7: length 63.3
  Top Layer w0.305: v1(53.47,44.92) 53.47,45.42 54.61,46.57 U1.43
  Top Layer w0.508: R19.2 29.7,81.63 30.35,80.98 H9.1
  Bottom Layer w0.355: H9.1 30.35,72.6 31.24,71.71 47.24,71.71 48.64,70.31 48.64,59.14 H16.1 48.51,58.5 50.04,56.98 50.04,45.68 50.8,44.92 v1(53.47,44.92)
PB10: length 25.6
  Top Layer w0.254: U1.21 56.13,39.38 56.13,36.53 56.51,36.15 58.8,36.15 59.31,35.64 59.31,25.99 59.94,25.36 H11.1
PB11: length 22.3
  Top Layer w0.254: U1.22 56.61,37.2 57.02,36.79 59.06,36.79 59.94,35.9 59.94,28.53 60.58,27.9 H11.2
PB12: length 18.1
  Top Layer w0.254: U1.25 59.11,39.9 59.56,39.45 64.01,39.45 64.39,39.07 64.39,34.88 65.91,33.36 65.91,31.2 66.68,30.44 H11.3
PB13: length 15.4
  Top Layer w0.254: U1.26 60.54,41.39 61.85,40.09 64.64,40.09 65.02,39.71 65.02,35.52 67.56,32.98 H11.4
PB14: length 14.6
  Top Layer w0.254: U1.27 61.06,41.89 62.23,40.72 65.28,40.72 65.66,40.34 65.66,36.03 66.17,35.52 H11.5
PB15: length 12.9
  Top Layer w0.254: H11.6 68.45,37.93 66.8,37.93 66.42,38.31 66.42,40.85 65.79,41.49 62.48,41.49 61.57,42.39 U1.28
SWCLK: length 42.8
  Top Layer w0.305: H1.3 71.88,74.76 71.37,74.25 71.37,59.39 70.36,58.38 67.18,58.38 66.55,57.74 66.55,48.98 65.53,47.96 57.68,47.96 U1.37
SWDIO: length 41.3
  Top Layer w0.305: U1.34 66.9,45.39 67.69,46.19 67.69,56.6 68.45,57.36 71.63,57.36 72.52,58.25 72.52,71.46 73.28,72.22 H1.2
$1N246: length 11.4
  Top Layer w0.508: 14.03,49.16 11.8,49.16 11.02,49.94 R13.1 11.17,54 R14.2
$1N2412: length 26.7
  Top Layer w0.635: L1.1 26.58,62.91 22.1,67.39 22.1,76.16 21.34,76.92 18.33,76.92 17.85,77.4 U6.1
$1N3223: length 4
  Top Layer w0.254: U4.7 5.44,38.6 R11.1
$1N3224: length 14.7
  Top Layer w0.254: LED5.1 3.1,27.26 2.16,27.26 1.65,27.77 1.65,36.41 2.16,36.91 3.94,36.91 4.19,37.17 4.19,38.61
$1N3229: length 3.9
  Top Layer w0.254: R10.2 5.44,44.63 U4.2
$1N3661: length 5.4
  Top Layer w0.635: LED6.1 LED10.2
$1N3707: length 5.4
  Top Layer w0.635: LED10.1 LED14.2
$1N3753: length 5.4
  Top Layer w0.635: 57.85,85.25 63.29,85.25
$1N3931: length 5.4
  Top Layer w0.635: LED7.1 LED11.2
$1N3933: length 5.4
  Top Layer w0.635: LED11.1 LED15.2
$1N3935: length 5.4
  Top Layer w0.635: 57.85,79.25 63.29,79.25
$1N4113: length 5.4
  Top Layer w0.635: 42.42,73.56 47.86,73.56
$1N4115: length 5.4
  Top Layer w0.635: 50.14,73.56 55.58,73.56
$1N4117: length 5.4
  Top Layer w0.635: 57.89,73.64 63.33,73.64
$1N4295: length 5.4
  Top Layer w0.635: 42.42,67.51 47.86,67.51
$1N4297: length 5.4
  Top Layer w0.635: 50.14,67.51 55.58,67.51
$1N4299: length 5.4
  Top Layer w0.635: 57.89,67.58 63.33,67.58
$1N4815: length 22.9
  Top Layer w0.254: v1(9.4,14.69) 8.4,15.69 6.68,15.69 ; v1(19.18,7.45) R8.2
  Bottom Layer w0.254: v1(9.4,14.69) 9.4,7.2 10.29,6.31 18.03,6.31 v1(19.18,7.45)
$1N4872: length 16
  Top Layer w0.254: v1(10.16,13.42) 9.43,12.69 6.68,12.69 ; v1(15.37,7.45) R9.2
  Bottom Layer w0.254: v1(10.16,13.42) 10.16,8.47 11.18,7.45 v1(15.37,7.45)
$1N5072: length 3.4
  Top Layer w0.254: R5.1 53.11,18.38 LED1.2
$1N5233: length 4.1
  Top Layer w0.254: R6.1 71.79,18.32 71.79,14.69
$1N7576: length 3.9
  Top Layer w0.254: LED22.2 19.59,68.21 R15.1
$1N7618: length 7.3
  Top Layer w0.508: R20.1 14.36,59.07 13.08,57.79 13.08,53.91 R13.2
$1N7867: length 5
  Top Layer w0.254: LED23.2 80.28,20.53 77.47,20.53 77.07,20.13 R21.1
$1N7949: length 10.6
  Top Layer w0.254: LED24.2 79.24,43.03 R22.1
$1N8425: length 3.7
  Top Layer w0.254: LED5.2 5.44,27.26 R12.1
$1N10744: length 3.7
  Top Layer w0.254: LED4.1 3.44,31.31 R11.2

## Copper pours and planes (outline as drawn; the poured copper is in the pictures)
+3.7V on Top Layer: 15.36,47.5 14.6,47.5 14.6,45.34 12.53,45.34 12.53,38.65 12.57,38.61 25.02,38.61 25.02,43.18 18.16,43.18 15.36,45.97
+3.7V on Top Layer: 12.57,42.88 19.56,42.88 19.56,31.71 12.57,31.71
+14V on Top Layer: 6.86,81.62 14.99,81.62 14.99,72.6 6.86,72.6
+14V on Top Layer: 12.82,74.55 12.82,59.4 8.22,59.4 8.22,74.55
+14V on Top Layer: 22.35,63.84 24.38,61.81 24.38,55.2 18.01,55.2 18.01,63.84
+14V on Bottom Layer: 24.51,64.01 24.51,59.4 10.26,59.4 10.26,64.01
GND on Top Layer: 0,90 90.04,90 90.04,-0.04 0,-0.04
GND on Bottom Layer: 0,90 90.04,90 90.04,-0.04 0,-0.04
$1N536 on Top Layer: 18.41,51.18 18.41,48.39 15.62,48.39 15.62,51.18
$1N536 on Top Layer: 24.97,54.1 24.97,45.16 18.03,45.16 18.03,54.1

Small or netless copper shapes (teardrops, artwork), in the pictures only: 259 on Top Layer, 58 on Bottom Layer

## Text on the board
Bottom Silkscreen Layer: QinYuYQY. | 2025/10/19 (雪) | 拖 / 带 / 苍 / 白 / 。 | 寒 / 冷 / 彻 / 骨 / 的 / 夜 / 的 / 寂 / 静 / ， | 就 / 是 / 雪 / 国 / 。 | 穿 / 过 / 县 / 界 / 长 / 长 / 的 / 隧 / 道 / ， | 雪 / 国 | 川 / 端 / 康 / 成
Top Silkscreen Layer: TC4056A | MT3608 | L2 | BAT | OFF | 5V | Boost-ON | B+ | PA11 | PA12 | GND | DN | DP | +5V | CLK | DIO | +3.3V | stm32f103c6 | ME6206 / A33 | PB15 | PB14 | PB13 | PB12 | PB11 | PB10 | QinYuYQY. | +14V | LED- | MT-EN | LED+ | PT-DIM | PA0 | PA1 | PA2 | PA3 | PA4 | PA5 | PB7 | PA6 | PB8 | PA7 | PB9 | PB0 | PA8 | PB1 | Key0 | Key1 | Key3 | Key4 | PA10 | PA9 | U1R | U1T | Boost升压控制 | 电流控制 / LED部分 | PT4115 | ME6206A33 | RST
